# Altium schematic sheet Temp_sensors.SchDoc
size A3; Organization: Altium Limited; Address1: L3, 12a Rodborough Rd; Address2: Frenchs Forest; Address3: NSW; Address4: Australia 2086
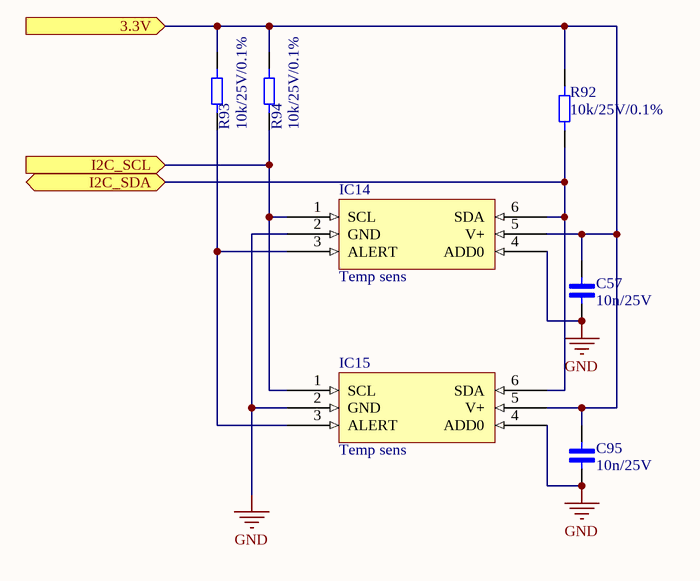
[diagram p0: Temp_sensors.SchDoc]

## Parts
C57  10n/25V  [Cap_0402]
C95  10n/25V  [Cap_0402]
IC14  Temp sens  [SOT563]
IC15  Temp sens  [SOT563]
R92  10k/25V/0.1%  [RES_0402]
R93  10k/25V/0.1%  [RES_0402]
R94  10k/25V/0.1%  [RES_0402]

## Ports
3.3V (in), I2C_SCL (in), I2C_SDA (bidir)

## Nets
GND: C57.1 C95.1 IC14.2(GND) IC14.4(ADD0) IC15.2(GND) IC15.4(ADD0)
3.3V: C57.2 C95.2 IC14.5(V+) IC15.5(V+) R92.2 R93.2 R94.2 ; port 3.3V
I2C_SCL: IC14.1(SCL) IC15.1(SCL) R94.1 ; port I2C_SCL
I2C_SDA: IC14.6(SDA) IC15.6(SDA) R92.1 ; port I2C_SDA
NetIC14_3: IC14.3(ALERT) IC15.3(ALERT) R93.1

## Notes on the sheet
- Title
- Size:
- Date:
- A3
- Number:
- Time:
- Revision:
- Sheet
- of
- File:

## Library data of the parts
C57 C95 = Cap_0402_10n: Ceramic Capacitor 10n / 0402 / 25V / ±5%, Wurth Elektronik MLCC; ComponentLink1Description: New link; ComponentLink1URL: https://www.we-online.com/catalog/en/WCAP-CSGP-25VDC
IC14 IC15 = TMP102-Q1: Temperature sensor, TMP102-Q1 Low-Power Digital Temperature Sensor With SMBus / and Two-Wire Serial Interface in SOT563; ComponentLink1Description: New link; ComponentLink1URL: https://www.ti.com/lit/ds/symlink/tmp102-q1.pdf?ts=1605094603566&ref_url=https%253A%252F%252Fwww.ti.com%252Fproduct%252FTMP102-Q1
R92-R94 = Res_0402_10k: Vishay, thin film resistor 10k/25V/0.1%